# Altium schematic sheet SH5 - CAN.SchDoc: CAN
size B; CheckedBy: Lance Bantoto; Engineer: Wolfgang Windholtz; Organization: UW Robotics; Address1: 200 University Avenue; Address2: Waterloo; Address3: Ontario; Address4: Canada N2L 3G6; Revision: 2; SheetNumber: 5; SheetTotal: 5
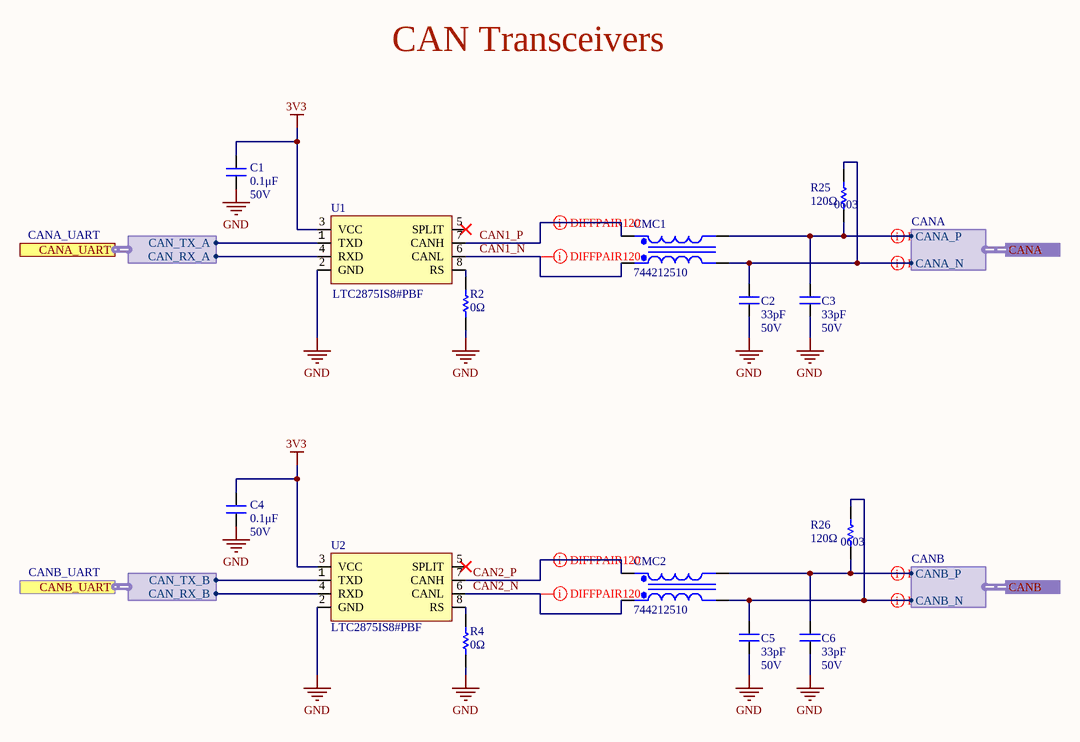
[diagram p0: SH5 - CAN.SchDoc]

## Parts
C1  value 0.1μF  Voltage Rating: 50V  [CAP0603]  (hidden comment: CAP_0.1uF_50V_0603)
C2  value 33pF  Voltage: 50V  [CAP0603]  (hidden comment: CAP_33pF_50V_0603)
C3  value 33pF  Voltage: 50V  [CAP0603]  (hidden comment: CAP_33pF_50V_0603)
C4  value 0.1μF  Voltage Rating: 50V  [CAP0603]  (hidden comment: CAP_0.1uF_50V_0603)
C5  value 33pF  Voltage: 50V  [CAP0603]  (hidden comment: CAP_33pF_50V_0603)
C6  value 33pF  Voltage: 50V  [CAP0603]  (hidden comment: CAP_33pF_50V_0603)
CMC1  CMC_51uH  [744212510]  (value not drawn)
CMC2  CMC_51uH  [744212510]  (value not drawn)
R2  value 0Ω  [RESC0603]  (hidden comment: RES_0Ω_0603)
R4  value 0Ω  [RESC0603]  (hidden comment: RES_0Ω_0603)
R25  value 120Ω  Package/Footprint: 0603  [RESC0603]  (hidden comment: RES_120Ω_0603)
R26  value 120Ω  Package/Footprint: 0603  [RESC0603]  (hidden comment: RES_120Ω_0603)
U1  Manufacturer Part Number 1: LTC2875IS8#PBF  [LT-S8_N]  (hidden comment: LTC2875)
U2  Manufacturer Part Number 1: LTC2875IS8#PBF  [LT-S8_N]  (hidden comment: LTC2875)

## Ports
CANA (harness CANA), CANA_UART (harness CANA_UART), CANB (harness CANB), CANB_UART (harness CANB_UART)

## Harnesses
CANA_UART: CAN_RX_A, CAN_TX_A
CANA: CANA_N, CANA_P
CANB: CANB_N, CANB_P
CANB_UART: CAN_RX_B, CAN_TX_B

## Nets
3V3: C1.1 C4.1 U1.3(VCC) U2.3(VCC)
GND: C1.2 C2.1 C3.1 C4.2 C5.1 C6.1 R2.1 R4.1 U1.2(GND) U2.2(GND)
CAN1_N: CMC1.1(Pri+) U1.6(CANL)
CAN1_P: CMC1.3(Sec+) U1.7(CANH)
CAN2_N: CMC2.1(Pri+) U2.6(CANL)
CAN2_P: CMC2.3(Sec+) U2.7(CANH)
NetC2_2: C2.2 CMC1.5(Pri-) R25.2 ; port CANA.CANA_N
NetC3_2: C3.2 CMC1.4(Sec-) R25.1 ; port CANA.CANA_P
NetC5_2: C5.2 CMC2.5(Pri-) R26.2 ; port CANB.CANB_N
NetC6_2: C6.2 CMC2.4(Sec-) R26.1 ; port CANB.CANB_P
NetR2_2: R2.2 U1.8(RS)
NetR4_2: R4.2 U2.8(RS)
NetU1_1: U1.1(TXD) ; port CANA_UART.CAN_TX_A
NetU1_4: U1.4(RXD) ; port CANA_UART.CAN_RX_A
NetU2_1: U2.1(TXD) ; port CANB_UART.CAN_TX_B
NetU2_4: U2.4(RXD) ; port CANB_UART.CAN_RX_B

Not connected (* = marked no-connect by the designer): U1 5(SPLIT)*; U2 5(SPLIT)*

## Layout directives
differential pair: CAN1_N, CAN1_P, CAN2_N, CAN2_P, NetC2_2, NetC3_2, NetC5_2, NetC6_2

## Notes on the sheet
- CAN Transceivers
- Title:
- Project:
- Date:
- Rev:
- Checker:
- Engineer:
- Sheet:
- of

## Library data of the parts
C1 C4 = CAP_0.1uF_50V_0603: CAP CER 0.1UF 50V X7R 0603; Manufacturer Part Number 1: CC0603KRX7R9BB104; Manufacturer 1: Yageo; Package/Footprint: 0603; Temperature Coefficient: X7R; Supplier Part Number 1: 311-1344-1-ND; Supplier 1: Digi-Key; Dielectric: X7R; Mounting Type: SMD
C2 C3 C5 C6 = CAP_33pF_50V_0603: CAP CER 33PF 50V C0G/NP0; Manufacturer 1: Yageo; Manufacturer Part Number 1: CC0603JRNPO9BN330; Dielectric Material: Ceramic; Temperature Coefficient: 30ppm/°C; Tolerance: 5%; Dielectric: C0G; Insulation Resistance: 100GR; Package/Footprint: 0603; Supplier 1: Digi-Key; Mount: Surface Mount; Number of Pins: 2; Case Code (Metric): 1608; Min Operating Temperature: -55°C; Max Operating Temperature: 125°C; Composition: Ceramic; Voltage Rating: 50V; Voltage Rating (DC): 50V; Length: 1.6mm; Height: 0.8mm; Thickness: 0.035inch; Depth: 0.8mm; Width: 0.031inch; REACH SVHC: No SVHC; Supplier Part Number 1: 311-1064-1-ND; Mounting Type: SMD
CMC1 CMC2 = CMC_51uH: CMC 51uH 300MA 2LN SMD; Manufacturer 1: Wurth Electronics; Core Material: Ferrite; DC Resistance (DCR): 160mR; Test Frequency: 100kHz; Inductance Tolerance: 50%; Voltage Rating (DC): 80V; Number of Lines: 2; Impedance: 300R; Supplier 1: Digi-Key; Manufacturer Part Number 1: 744212510; Mount: Surface Mount; Number of Pins: 4; Min Operating Temperature: -40°C; Max Operating Temperature: 105°C; Current: 300mA; Max DC Current: 300mA; Current Rating: 300mA; Inductance: 51uH; Tolerance: 50%; Length: 6.5mm; Height: 1.65mm; Depth: 3.6mm; Width: 0.142inch; REACH SVHC: No SVHC; ComponentLink7URL: https://datasheet.ciiva.com/6216/744212510-6216348.pdf?src-supplier=Digi-Key; ComponentLink7Description: https://datasheet.ciiva.com/6216/744212510-6216348.pdf?src-supplier=Digi-Key; ComponentLink8URL: https://datasheet.ciiva.com/7764/1735560-7764951.pdf?src-supplier=Element14; ComponentLink8Description: https://datasheet.ciiva.com/7764/1735560-7764951.pdf?src-supplier=Element14; Supplier Part Number 1: 732-3941-1-ND; Package/Footprint: SMD; Mounting Type: SMD
R2 R4 = RES_0Ω_0603: RES 0 OHM JUMPER 1/10W 0603; Manufacturer 1: Yageo; Manufacturer Part Number 1: RC0603JR-070RL; Package/Footprint: 0603; Supplier Part Number 1: 311-0.0GRCT-ND; Supplier 1: Digi-Key; Mounting Type: SMD
R25 R26 = RES_120Ω_0603_5%: RES 120 OHM 5% 1/10W 0603; Manufacturer 1: Yageo; Manufacturer Part Number 1: RC0603JR-07120RL; Package: 0603 (1608 Metric); Supplier Part Number 1: 311-120GRCT-ND; Supplier 1: Digi-Key; Mounting Type: SMD
U1 U2 = LTC2875: IC TXRX CAN 4MBPS 8SO; Manufacturer 1: Linear Technologies; Package/Footprint: 8-SOIC; Supplier Part Number 1: LTC2875IS8#PBF-ND; Supplier 1: Digi-Key; Mounting Type: SMD; LCSC Part #: C117076